# Altium schematic sheet programming.SchDoc
size A4; DocumentNumber: 5; SheetNumber: 5; SheetTotal: 5
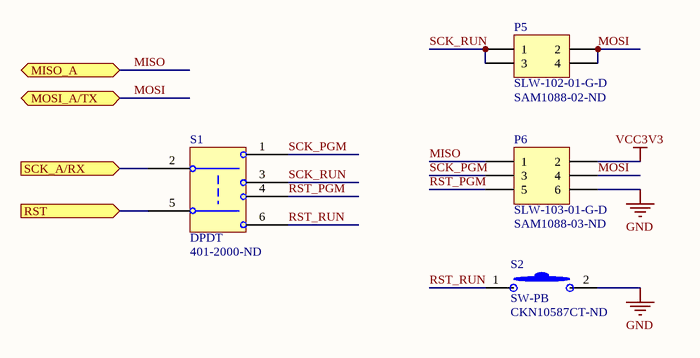
[diagram p0: programming.SchDoc]

## Parts
P5  SLW-102-01-G-D  Supplier Part Number 1: SAM1088-02-ND  [SLW-102-01-X-D]
P6  SLW-103-01-G-D  Supplier Part Number 1: SAM1088-03-ND  [SLW-103-01-X-D]
S1  DPDT  Supplier Part Number 1: 401-2000-ND  [JS202011AQN - Slide Switch]
S2  SW-PB  Supplier Part Number 1: CKN10587CT-ND  [PTS830GM140 SMTR LFS - Pushbutton]

## Ports
MISO_A (bidir), MOSI_A/TX (bidir), RST (in), SCK_A/RX (in)

## Nets
GND: P6.6 S2.2
VCC3V3: P6.2
MISO: P6.1 ; port MISO_A
MOSI: P5.2 P5.4 P6.4 ; port MOSI_A/TX
RST: S1.5(POLE2) ; port RST
RST_PGM: P6.5 S1.4(POLE2A)
RST_RUN: S1.6(POLE2B) S2.1
SCK_A/RX: S1.2(POLE1) ; port SCK_A/RX
SCK_PGM: P6.3 S1.1(POLE1A)
SCK_RUN: P5.1 P5.3 S1.3(POLE1B)

## Library data of the parts
P5 = SLW-102-01-G-D: 4 pos 100mil pitch low profile header; Supplier 1: Digi-Key
P6 = SLW-103-01-G-D: 6 pos 100mil pitch low profile header; Supplier 1: Digi-Key
S1 = DPDT Switch: DPDT Switch, customized for the pinout of the JS202011AQN switch.; Supplier 1: Digi-Key
S2 = Pushbutton - Low Profile: Schematic symbol for a generic 2-pin pushbutton, OFF-mom.; Supplier 1: Digi-Key